# Altium schematic sheet Board.SCHDOC: FPGA Rack
size 420 x 297 mm; DrawnBy: zas; Revision: V1.0; SheetNumber: 2; SheetTotal: 25; DocumentName: Board.SCHDOC
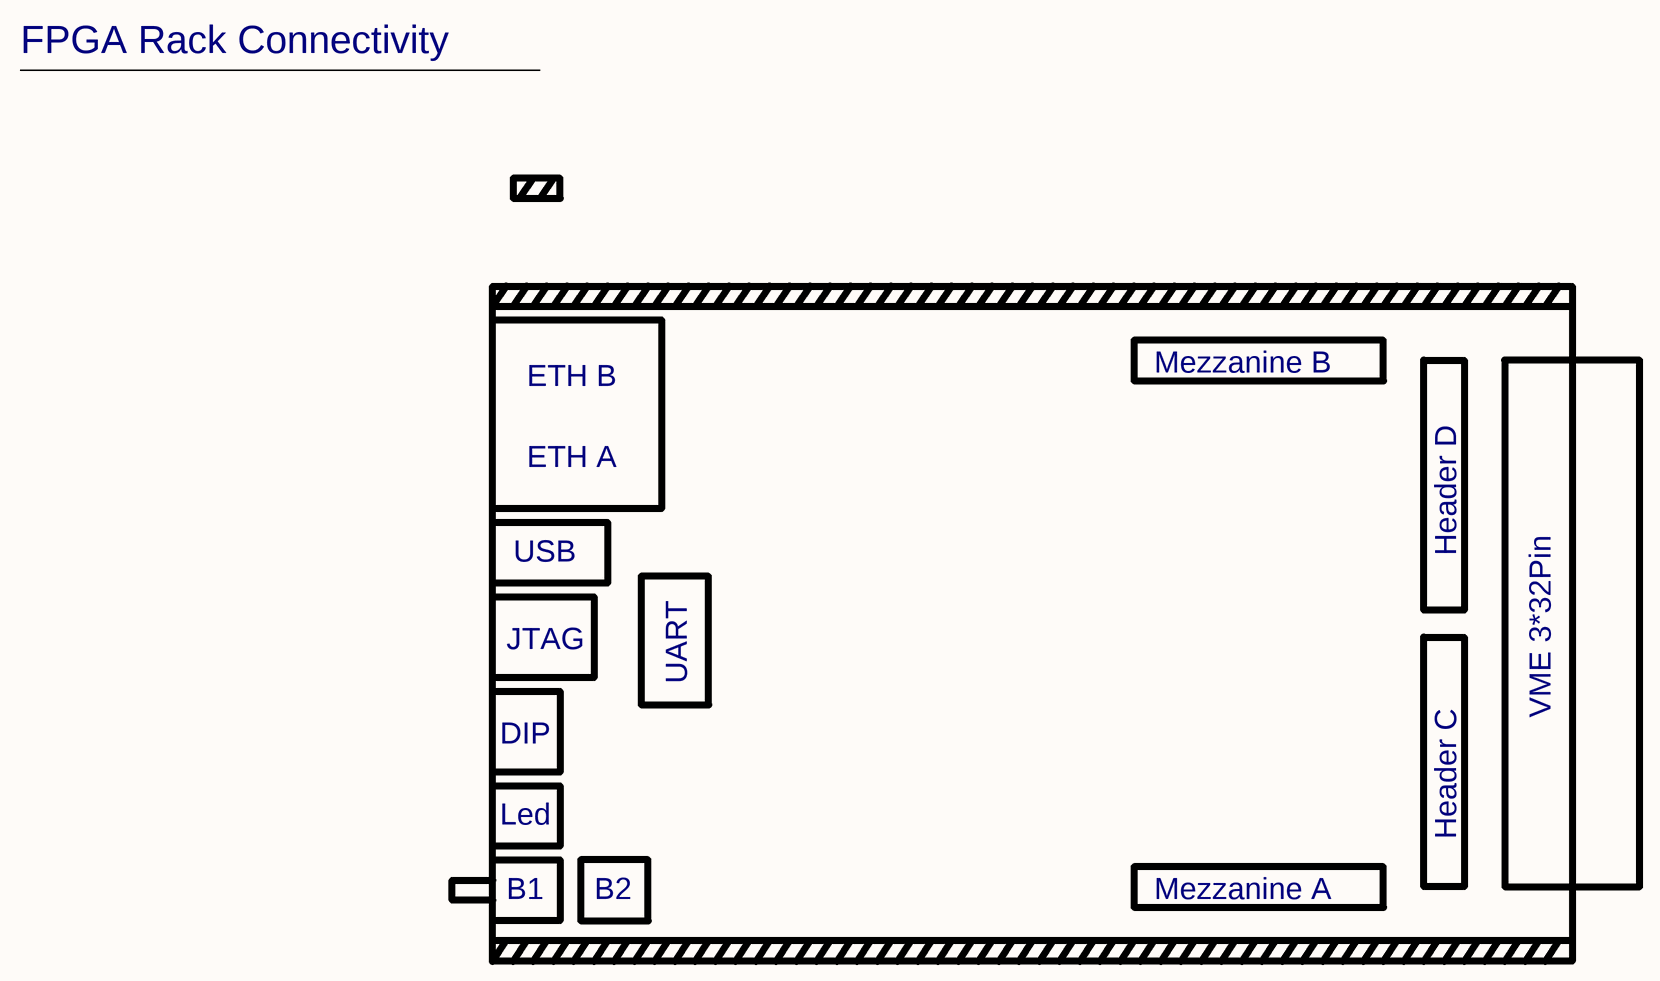
[diagram p0: Board.SCHDOC]

## Notes on the sheet
- FPGA Rack Connectivity
- Mezzanine B
- ETH B
- ETH A
- USB
- Header D
- JTAG
- UART
- VME 3*32Pin
- DIP
- Led
- Header C
- B1
- B2
- Mezzanine A
- DES
- HES-SO // Valais Wallis
- HAUTE ECOLE VALAISANNE
- /
- REV
- {Path}